# EAGLE design 5V-Module (EAGLE 9.6.2)
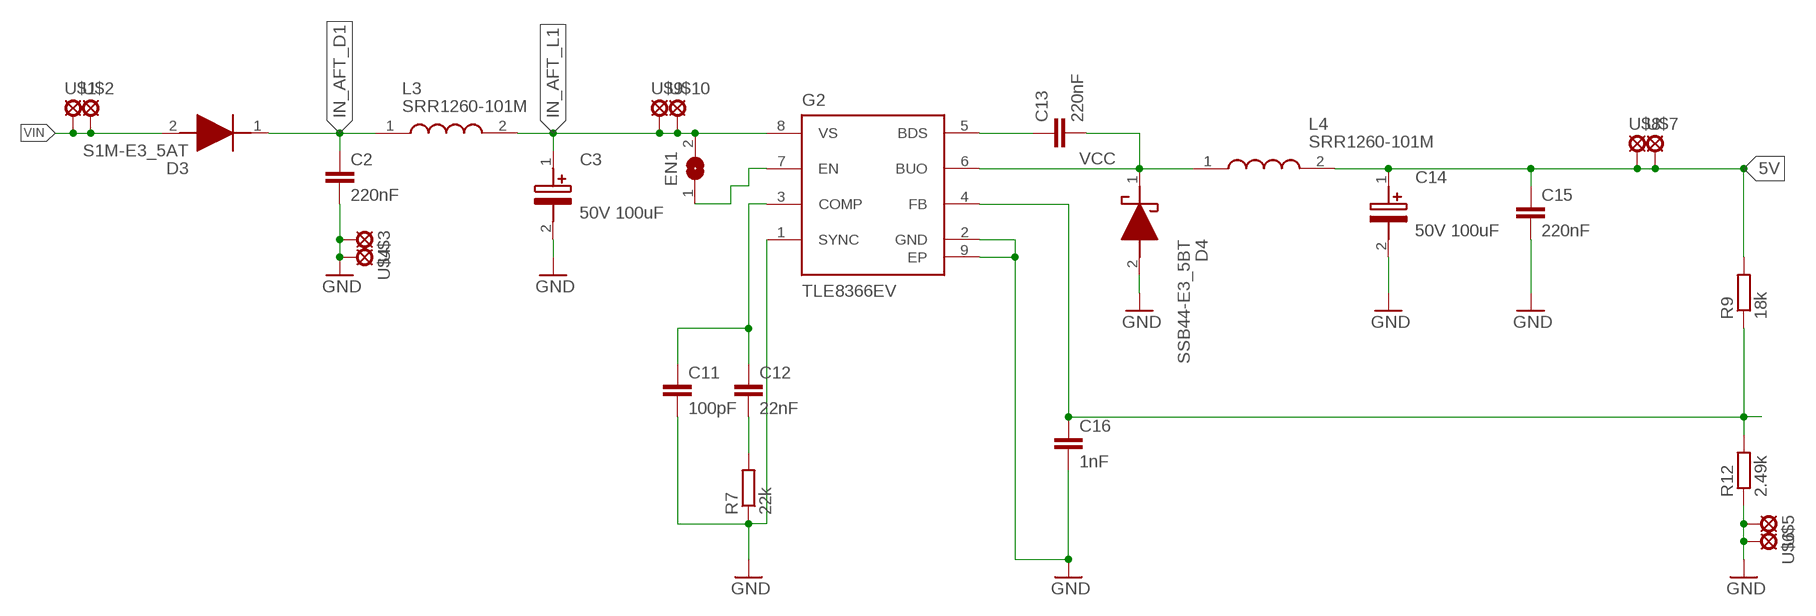
[diagram p0: schematic, sheet 1]

## Parts
C2  220nF  C-EUC0603  [C0603]
C3  50V 100uF  865060653010  [CAPAE830X1050N]
C11  100pF  C-EUC0603  [C0603]
C12  22nF  C-EUC0603  [C0603]
C13  220nF  C-EUC0603  [C0603]
C14  50V 100uF  865060653010  [CAPAE830X1050N]
C15  220nF  C-EUC0603  [C0603]
C16  1nF  C-EUC0603  [C0603]
D3  S1M-E3_5AT  [DIOM5127X229N]
D4  SSB44-E3_5BT  [DIOM5436X244N]
EN1  SJ  [SJ]
G2  TLE8366EV  [SOIC127P600X170-9N-1]
L3  SRR1260-101M  [SRR1260101M]
L4  SRR1260-101M  [SRR1260101M]
R7  22k  R-EU_R0603  [R0603]
R9  18k  R-EU_R0603  [R0603]
R12  2.49k  R-EU_R0603  [R0603]
U$1  2MM_PAD  [2MM_PAD]
U$2  2MM_PAD  [2MM_PAD]
U$3  2MM_PAD  [2MM_PAD]
U$4  2MM_PAD  [2MM_PAD]
U$5  2MM_PAD  [2MM_PAD]
U$6  2MM_PAD  [2MM_PAD]
U$7  2MM_PAD  [2MM_PAD]
U$8  2MM_PAD  [2MM_PAD]
U$9  2MM_PAD  [2MM_PAD]
U$10  2MM_PAD  [2MM_PAD]

## Nets
5V: C14.1(+) C15.1 L4.2 R9.2 U$7.P$1(MP) U$8.P$1(MP)
GND: C2.2 C3.2(-) C11.2 C14.2(-) C15.2 C16.2 D4.2(A) G2.1(SYNC) G2.2(GND) G2.9(EP) R7.1 R12.1 U$3.P$1(MP) U$4.P$1(MP) U$5.P$1(MP) U$6.P$1(MP)
IN_AFT_D1: C2.1 D3.1(K) L3.1
IN_AFT_L1: C3.1(+) EN1.2 G2.8(VS) L3.2 U$9.P$1(MP) U$10.P$1(MP)
N$2: C11.1 C12.1 G2.3(COMP)
N$6: C12.2 R7.2
N$12: C13.1 G2.5(BDS)
N$13: C16.1 G2.4(FB) R9.1 R12.2
N$18: EN1.1 G2.7(EN)
VCC: C13.2 D4.1(K) G2.6(BUO) L4.1
VIN: D3.2(A) U$1.P$1(MP) U$2.P$1(MP)

## Library data of the parts
C2 C11-C13 C15 C16 = rcl:C-EU: CAPACITOR, European symbol; SPICEPREFIX: C
C3 C14 = 865060653010:865060653010: Wurth Elektronik 100uF Electrolytic Capacitor 50V dc, Surface Mount - 865060653010 Source: Datasheet <https://componentsearchengine.com/Datasheets/2/865060653010.pdf>; DESCRIPTION: Wurth Elektronik 100uF Electrolytic Capacitor 50V dc, Surface Mount - 865060653010; HEIGHT: 10.5mm; MANUFACTURER_NAME: Wurth Elektronik; MANUFACTURER_PART_NUMBER: 865060653010; MOUSER_PART_NUMBER: 710-865060653010; MOUSER_PRICE-STOCK: https://www.mouser.co.uk/ProductDetail/Wurth-Elektronik/865060653010?qs=0KOYDY2FL2%252BoVBl9%252BvxW%2Fg%3D%3D
D3 = S1M-E3_5AT:S1M-E3_5AT: Vishay 1000V 1A, Diode, 2-Pin DO-214AC S1M-E3/5AT Source: Datasheet <https://www.vishay.com/docs/88711/s1.pdf>; DESCRIPTION: Vishay 1000V 1A, Diode, 2-Pin DO-214AC S1M-E3/5AT; HEIGHT: 2.29mm; MANUFACTURER_NAME: Vishay; MANUFACTURER_PART_NUMBER: S1M-E3/5AT; MOUSER_PART_NUMBER: 625-S1M-E3/5AT; MOUSER_PRICE-STOCK: https://www.mouser.co.uk/ProductDetail/Vishay-General-Semiconductor/S1M-E3-5AT?qs=lBalI7KQBwoSLCq1wVFE%2Fw%3D%3D
D4 = SSB44-E3_5BT:SSB44-E3_5BT: Rectifier Diode Schottky 40V 4A 2-Pin SMB T/R Source: Datasheet <http://www.vishay.com/docs/88884/ssb43l.pdf>; DESCRIPTION: Rectifier Diode Schottky 40V 4A 2-Pin SMB T/R; HEIGHT: 2.44mm; MANUFACTURER_NAME: Vishay; MANUFACTURER_PART_NUMBER: SSB44-E3/5BT; MOUSER_PART_NUMBER: 625-SSB44-E3/5BT; MOUSER_PRICE-STOCK: https://www.mouser.co.uk/ProductDetail/Vishay-General-Semiconductor/SSB44-E3-5BT?qs=x2jpVgRnAtPlxEbHZNqb7g%3D%3D
EN1 = jumper:SJ: SMD solder JUMPER
G2 = TLE8366EV:TLE8366EV: TLE8366EV 1.8A DC/DC Step-Down Voltage Regulator Adjustable SOIC127P600X170-9N-1
L3 L4 = SRR1260-101M:SRR1260-101M: Bourns SRR1260 Series Type 1260 Shielded Wire-wound SMD Inductor with a Ferrite Core, 100 uH +/-20% Wire-Wound 1.7A Idc Source: Datasheet <https://componentsearchengine.com/Datasheets/1/SRR1260-101M.pdf>; DESCRIPTION: Bourns SRR1260 Series Type 1260 Shielded Wire-wound SMD Inductor with a Ferrite Core, 100 uH +/-20% Wire-Wound 1.7A Idc; HEIGHT: 6.5mm; MANUFACTURER_NAME: Bourns; MANUFACTURER_PART_NUMBER: SRR1260-101M; MOUSER_PART_NUMBER: 652-SRR1260-101M; MOUSER_PRICE-STOCK: https://www.mouser.co.uk/ProductDetail/Bourns/SRR1260-101M?qs=uD%2FoUDWqfvQozr%2Ff4%252BPuSQ%3D%3D
R7 R9 R12 = rcl:R-EU_: RESISTOR, European symbol; SPICEPREFIX: R
U$1-U$10 = solpad:2MM_PAD

## Net classes
0 default: clearance 0.205 mm

## Board
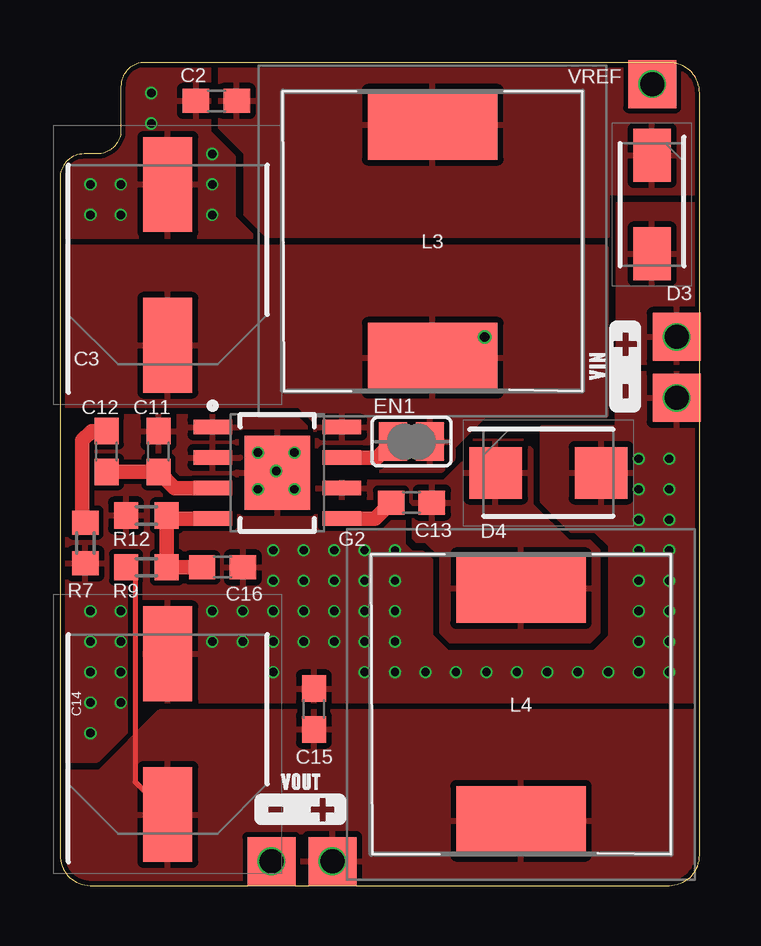
[diagram p1: board, top side]
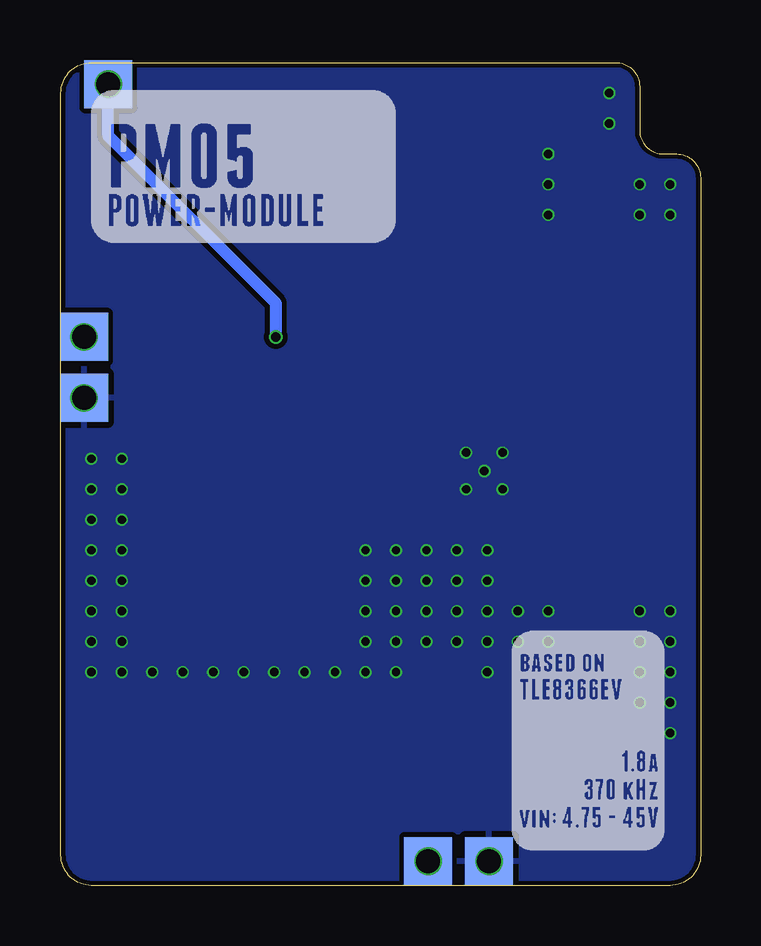
[diagram p2: board, bottom side, seen from below]

Size 26.67 x 34.29 mm. Coordinates in mm from the lower left corner, seen from the top.
Outline: 25.4,34.29 3.54,34.29 arc90 2.54,33.29 2.54,31.48 arc-90 1.54,30.48 1,30.48 arc90 0,29.48 0,1.27 arc90 1.27,0 25.4,0 arc90 26.67,1.27 26.67,33.02 arc90 25.4,34.29
Copper layers (1*16): Top 0.035mm / dielectric 1.6mm / Bottom 0.035mm
Design rules "jlcpcb-2layers *": minimum track width 5mil, minimum drill 0.3mm, track to track 5mil, track to pad 5mil, pad to pad 5mil, via to via 5mil, smd to smd 5mil, copper to edge 0.2mm, drill to drill 6mil, minimum pad ring 5mil, minimum via ring 3mil, stop-mask expansion 4mil, vias tented up to drill 0mil, thermal gap 10mil

### Footprints (pad centres in the part's own frame; a part is rotated, then mirrored left to right if it is on the bottom)
C0603 = smd 1.1 x 1: 1 -0.85,0; 2 0.85,0
CAPAE830X1050N = smd 3.95 x 2.05: 1 -3.35,0; 2 3.35,0
DIOM5127X229N = smd 2.2 x 1.55: 1 -2.05,0; 2 2.05,0
DIOM5436X244N = smd 2.2 x 2.15: 1 -2.2,0; 2 2.2,0
SJ = smd 1.168 x 1.6: 1 -0.762,0; 2 0.762,0
SOIC127P600X170-9N-1 = smd 1.6 x 0.61: 1 -2.692,1.905; 2 -2.692,0.635; 3 -2.692,-0.635; 4 -2.692,-1.905; 5 2.692,-1.905; 6 2.692,-0.635; 7 2.692,0.635; 8 2.692,1.905 | smd 2.743 x 3.099: 9 0,0
SRR1260101M = smd 2.9 x 5.4: 1 -4.85,0; 2 4.85,0
R0603 = smd 1 x 1.1: 1 -0.85,0; 2 0.85,0
2MM_PAD = smd 2 x 2: P$1 0,0

### Placement (x,y rotation side)
C2  6.52,32.69 180 top
C3  4.5,25.86 90 top
C11  4.11,18.08 90 top
C12  1.95,18.08 90 top
C13  14.66,15.96 0 top
C14  4.5,6.3 90 top
C15  10.59,7.35 90 top
C16  6.78,13.26 0 top
D3  24.68,28.37 270 top
D4  20.37,17.2 0 top
EN1  14.66,18.5 0 top
G2  9.06,17.2 0 top
L3  15.54,26.85 270 top
L4  19.22,7.54 270 top
R7  1.06,14.27 90 top
R9  3.6,13.26 180 top
R12  3.6,15.42 0 top
U$1  25.71,22.85 0 top
U$2  25.71,22.85 0 bottom
U$3  8.82,1.01 0 top
U$4  8.82,1.01 0 bottom
U$5  25.71,20.31 0 top
U$6  25.71,20.31 0 bottom
U$7  11.36,1.01 90 top
U$8  11.36,1.01 0 bottom
U$9  24.69,33.4 0 top
U$10  24.69,33.4 0 bottom

### Tracks (layer width: path | path; a pad name or v marks a point on that pad's centre or on a via)
5V  (via drill 1)
  Top 0.2: C14.1 3.13,4.32 3.13,13 2.88,13.26 R9.2
  other vias: 11.36,1.01
  pour Top: 26.67,7.24 4.16,7.24 1.65,4.73 0,4.73 0,1.27 arc90 1.27,0 25.4,0 arc90 26.67,1.27
GND  (via drill 0.35, 1)
  Top 0.127: U$4.P$1 8.07,0.26
  other vias: 1.27,11.43 2.54,11.43 2.54,10.16 1.27,10.16 1.27,8.89 2.54,8.89 1.27,7.62 8.89,13.97 8.89,12.7 8.89,11.43 10.16,10.16 10.16,11.43 10.16,12.7 10.16,13.97 11.43,13.97 11.43,12.7 11.43,11.43 11.43,10.16 12.7,10.16 12.7,11.43 12.7,12.7 12.7,13.97 13.97,13.97 13.97,11.43 13.97,12.7 13.97,10.16 13.97,8.89 15.24,8.89 16.51,8.89 17.78,8.89 19.05,8.89 20.32,8.89 21.59,8.89 22.86,8.89 24.13,8.89 25.4,8.89 25.4,10.16 24.13,10.16 24.13,11.43 25.4,11.43 25.4,12.7 24.13,12.7 24.13,13.97 25.4,13.97 25.4,15.24 24.13,15.24 24.13,16.51 25.4,16.51 25.4,17.78 24.13,17.78 2.54,27.94 1.27,27.94 1.27,29.21 2.54,29.21 3.81,31.75 3.81,33.02 6.35,30.48 6.35,29.21 6.35,27.94 8.25,16.51 9.02,17.27 9.78,16.51 8.25,18.03 9.78,18.03 8.89,10.16 8.89,8.89 6.35,11.43 6.35,10.16 7.62,11.43 2.54,7.62 7.62,10.16 1.27,6.35 12.7,8.89 25.71,20.31 8.82,1.01
  pour Top: 0,27.05 8,27.05 7.24,27.81 7.24,30.35 6.22,31.37 6.22,34.29 3.54,34.29 arc90 2.54,33.29 2.54,31.48 arc-90 1.54,30.48 1,30.48 arc90 0,29.48
  pour Top: 20.12,16 20.12,19.1 23.24,19.1 23.24,21.34 26.67,21.34 26.67,7.67 3.99,7.67 1.52,5.21 0,5.21 0,19.56 9.78,19.56 10.24,19.1 10.24,16.05 10.59,15.7 14.3,15.7 14.3,14.2 14.63,13.87 15.09,13.87 15.37,13.59 15.44,13.59 15.44,10.41 16.13,9.73 22.3,9.73 22.96,10.39 22.96,14.15 22.32,14.78 21.34,14.78
  pour Bottom: 26.67,1.27 26.67,33.02 arc90 25.4,34.29 3.54,34.29 arc90 2.54,33.29 2.54,31.48 arc-90 1.54,30.48 1,30.48 arc90 0,29.48 0,1.27 arc90 1.27,0 25.4,0 arc90
IN_AFT_D1
  pour Top: 26.67,28.83 22.86,28.83 22.86,27.05 8.61,27.05 7.72,27.94 7.72,30.51 6.65,31.57 6.65,34.29 25.4,34.29 arc-90 26.67,33.02
IN_AFT_L1  (via drill 0.4, 1)
  Top 0.508: L3.2 16.85,22 v17.71,22.85
  Bottom 0.508: v17.71,22.85 17.71,24.25 24.69,31.24 U$10.P$1
  other vias: 24.69,33.4
  pour Top: 0,26.62 22.76,26.62 22.76,19.56 17.65,19.56 16.38,18.29 16.38,17.78 15.88,17.27 10.79,17.27 10.67,17.4 10.67,19.3 9.98,19.99 0,19.99
N$2
  Top 0.61: G2.3 4.78,16.56 C11.1 C12.1
N$6
  Top 0.61: C12.2 1.32,18.93 0.93,18.55 0.93,15.25 R7.2
N$12
  Top 0.61: G2.5 13.14,15.29 C13.1
N$13
  Top 0.61: G2.4 4.58,15.29 R12.2 R9.1 C16.1
N$18
  Top 0.61: EN1.1 13.23,17.83 G2.7
VCC
  pour Top: 10.74,16.84 16,16.84 16.81,17.65 16.81,18.11 17.25,18.54 19.3,18.54 19.68,18.16 19.68,15.88 21.21,14.35 22.1,14.35 22.48,13.97 22.48,10.54 22.1,10.16 16.26,10.16 15.88,10.54 15.88,13.72 15.24,14.35 14.86,14.35 14.73,14.48 14.73,15.88 14.48,16.13 10.79,16.13 10.72,16.21 10.72,16.81
VIN  (via drill 1)
  other vias: 25.71,22.85
  pour Top: 23.23,28.43 23.23,21.74 26.63,21.74 26.63,28.43

### Text on the board
tPlace: VREF